# EAGLE schematic M.2-Templates (EAGLE 9.6.2)
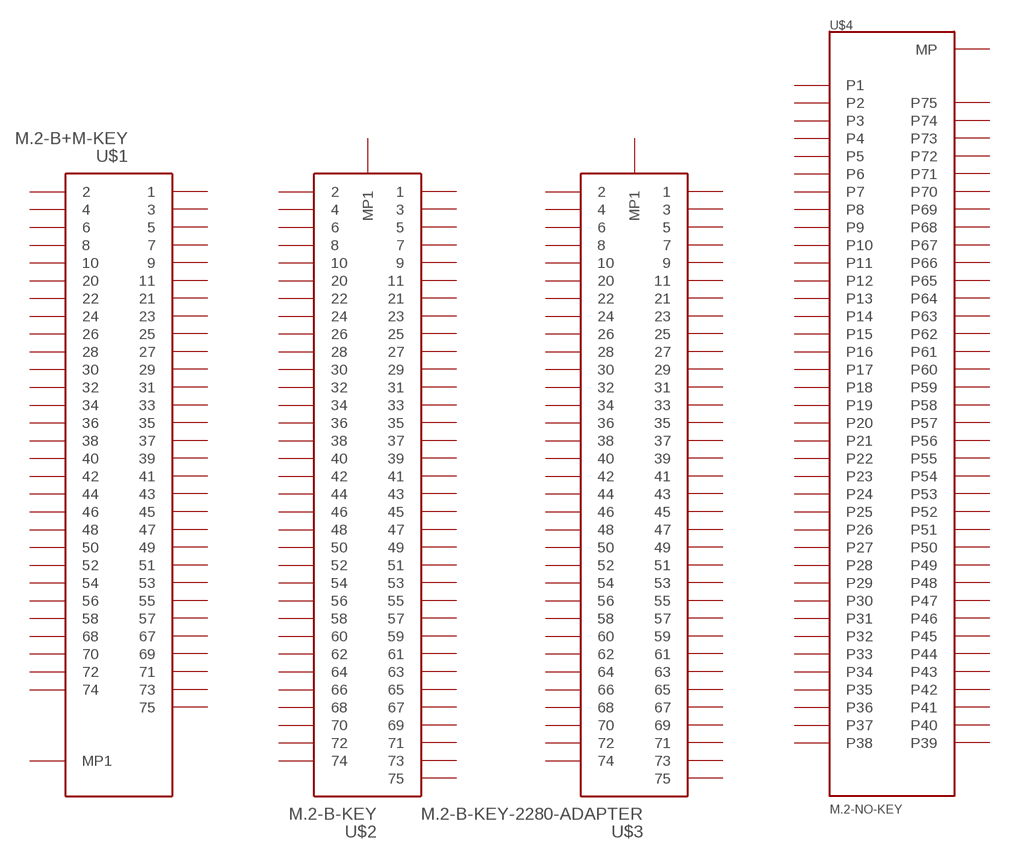
[diagram p0: schematic, sheet 1]

## Parts
U$1  M.2-B+M-KEY  [M.2-B+M-KEY]
U$2  M.2-B-KEY  [M.2-B-KEY]
U$3  M.2-B-KEY-2280-ADAPTER  [M.2-B-KEY-2280-ADAPTER]
U$4  M.2-NO-KEY  [M.2-KEY-BLANK]
Unconnected: U$1.MOUNTING-HOLE(MP1) U$1.P$1 U$1.P$2 U$1.P$3 U$1.P$4 U$1.P$5 U$1.P$6 U$1.P$7 U$1.P$8 U$1.P$9 U$1.P$10 U$1.P$11 U$1.P$20 U$1.P$21 U$1.P$22 U$1.P$23 U$1.P$24 U$1.P$25 U$1.P$26 U$1.P$27 U$1.P$28 U$1.P$29 U$1.P$30 U$1.P$31 U$1.P$32 U$1.P$33 U$1.P$34 U$1.P$35 U$1.P$36 U$1.P$37 U$1.P$38 U$1.P$39 U$1.P$40 U$1.P$41 U$1.P$42 U$1.P$43 U$1.P$44 U$1.P$45 U$1.P$46 U$1.P$47 U$1.P$48 U$1.P$49 U$1.P$50 U$1.P$51 U$1.P$52 U$1.P$53 U$1.P$54 U$1.P$55 U$1.P$56 U$1.P$57 U$1.P$58 U$1.P$67 U$1.P$68 U$1.P$69 U$1.P$70 U$1.P$71 U$1.P$72 U$1.P$73 U$1.P$74 U$1.P$75 U$2.MOUNTING-HOLE(MP1) U$2.P$1 U$2.P$2 U$2.P$3 U$2.P$4 U$2.P$5 U$2.P$6 U$2.P$7 U$2.P$8 U$2.P$9 U$2.P$10 U$2.P$11 U$2.P$20 U$2.P$21 U$2.P$22 U$2.P$23 U$2.P$24 U$2.P$25 U$2.P$26 U$2.P$27 U$2.P$28 U$2.P$29 U$2.P$30 U$2.P$31 U$2.P$32 U$2.P$33 U$2.P$34 U$2.P$35 U$2.P$36 U$2.P$37 U$2.P$38 U$2.P$39 U$2.P$40 U$2.P$41 U$2.P$42 U$2.P$43 U$2.P$44 U$2.P$45 U$2.P$46 U$2.P$47 U$2.P$48 U$2.P$49 U$2.P$50 U$2.P$51 U$2.P$52 U$2.P$53 U$2.P$54 U$2.P$55 U$2.P$56 U$2.P$57 U$2.P$58 U$2.P$59 U$2.P$60 U$2.P$61 U$2.P$62 U$2.P$63 U$2.P$64 U$2.P$65 U$2.P$66 U$2.P$67 U$2.P$68 U$2.P$69 U$2.P$70 U$2.P$71 U$2.P$72 U$2.P$73 U$2.P$74 U$2.P$75 U$3.MOUNTING-HOLE2(MP1) U$3.MOUNTING-HOLE(MP1) U$3.P$1 U$3.P$2 U$3.P$3 U$3.P$4 U$3.P$5 U$3.P$6 U$3.P$7 U$3.P$8 U$3.P$9 U$3.P$10 U$3.P$11 U$3.P$20 U$3.P$21 U$3.P$22 U$3.P$23 U$3.P$24 U$3.P$25 U$3.P$26 U$3.P$27 U$3.P$28 U$3.P$29 U$3.P$30 U$3.P$31 U$3.P$32 U$3.P$33 U$3.P$34 U$3.P$35 U$3.P$36 U$3.P$37 U$3.P$38 U$3.P$39 U$3.P$40 U$3.P$41 U$3.P$42 U$3.P$43 U$3.P$44 U$3.P$45 U$3.P$46 U$3.P$47 U$3.P$48 U$3.P$49 U$3.P$50 U$3.P$51 U$3.P$52 U$3.P$53 U$3.P$54 U$3.P$55 U$3.P$56 U$3.P$57 U$3.P$58 U$3.P$59 U$3.P$60 U$3.P$61 U$3.P$62 U$3.P$63 U$3.P$64 U$3.P$65 U$3.P$66 U$3.P$67 U$3.P$68 U$3.P$69 U$3.P$70 U$3.P$71 U$3.P$72 U$3.P$73 U$3.P$74 U$3.P$75 U$4.MOUNTING-HOLE(MP) U$4.P$1(P1) U$4.P$2(P2) U$4.P$3(P3) U$4.P$4(P4) U$4.P$5(P5) U$4.P$6(P6) U$4.P$7(P7) U$4.P$8(P8) U$4.P$9(P9) U$4.P$10(P10) U$4.P$11(P11) U$4.P$12(P12) U$4.P$13(P13) U$4.P$14(P14) U$4.P$15(P15) U$4.P$16(P16) U$4.P$17(P17) U$4.P$18(P18) U$4.P$19(P19) U$4.P$20(P20) U$4.P$21(P21) U$4.P$22(P22) U$4.P$23(P23) U$4.P$24(P24) U$4.P$25(P25) U$4.P$26(P26) U$4.P$27(P27) U$4.P$28(P28) U$4.P$29(P29) U$4.P$30(P30) U$4.P$31(P31) U$4.P$32(P32) U$4.P$33(P33) U$4.P$34(P34) U$4.P$35(P35) U$4.P$36(P36) U$4.P$37(P37) U$4.P$38(P38) U$4.P$39(P39) U$4.P$40(P40) U$4.P$41(P41) U$4.P$42(P42) U$4.P$43(P43) U$4.P$44(P44) U$4.P$45(P45) U$4.P$46(P46) U$4.P$47(P47) U$4.P$48(P48) U$4.P$49(P49) U$4.P$50(P50) U$4.P$51(P51) U$4.P$52(P52) U$4.P$53(P53) U$4.P$54(P54) U$4.P$55(P55) U$4.P$56(P56) U$4.P$57(P57) U$4.P$58(P58) U$4.P$59(P59) U$4.P$60(P60) U$4.P$61(P61) U$4.P$62(P62) U$4.P$63(P63) U$4.P$64(P64) U$4.P$65(P65) U$4.P$66(P66) U$4.P$67(P67) U$4.P$68(P68) U$4.P$69(P69) U$4.P$70(P70) U$4.P$71(P71) U$4.P$72(P72) U$4.P$73(P73) U$4.P$74(P74) U$4.P$75(P75)

## Library data of the parts
U$1 = M.2-Templates:M.2-B+M-KEY
U$2 = M.2-Templates:M.2-B-KEY
U$3 = M.2-Templates:M.2-B-KEY-2280-ADAPTER
U$4 = M.2-Templates:M.2-NO-KEY